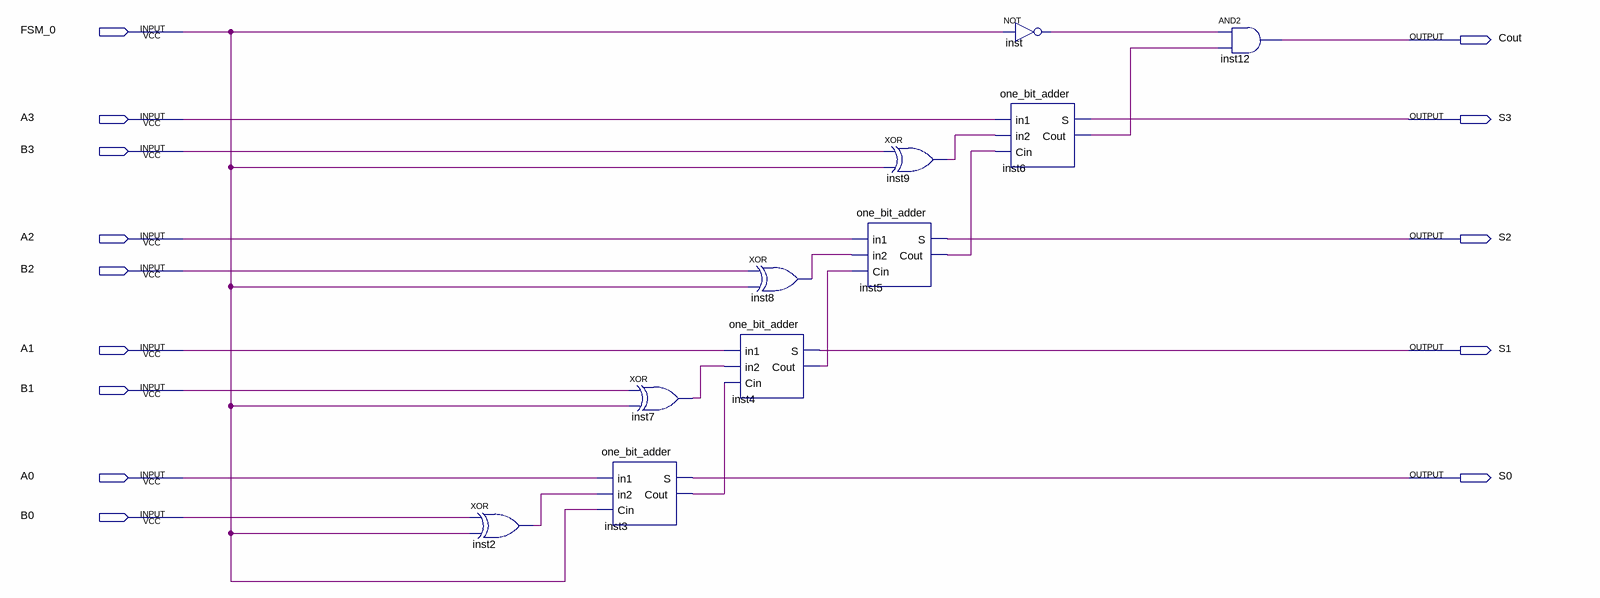
[diagram p0: schematic sheet]
// Quartus schematic four_bit_adder_subtracter.bdf as structural Verilog: 10 symbols, 14 pins
module four_bit_adder_subtracter (
  input  FSM_0,
  input  A3,
  input  B3,
  input  A2,
  input  B2,
  input  A1,
  input  B1,
  input  A0,
  input  B0,
  output Cout,
  output S3,
  output S2,
  output S1,
  output S0
);

  wire inst2_out, inst3_cout, inst4_cout, inst5_cout, inst6_cout, inst7_out, inst8_out, inst9_out, inst_out;

  xor inst2 (inst2_out, B0, FSM_0);
  xor inst7 (inst7_out, B1, FSM_0);
  one_bit_adder inst3 (.in1(A0), .in2(inst2_out), .Cin(FSM_0), .S(S0), .Cout(inst3_cout));
  xor inst8 (inst8_out, B2, FSM_0);
  one_bit_adder inst4 (.in1(A1), .in2(inst7_out), .Cin(inst3_cout), .S(S1), .Cout(inst4_cout));
  xor inst9 (inst9_out, B3, FSM_0);
  one_bit_adder inst5 (.in1(A2), .in2(inst8_out), .Cin(inst4_cout), .S(S2), .Cout(inst5_cout));
  not inst (inst_out, FSM_0);
  one_bit_adder inst6 (.in1(A3), .in2(inst9_out), .Cin(inst5_cout), .S(S3), .Cout(inst6_cout));
  and inst12 (Cout, inst_out, inst6_cout);
endmodule
